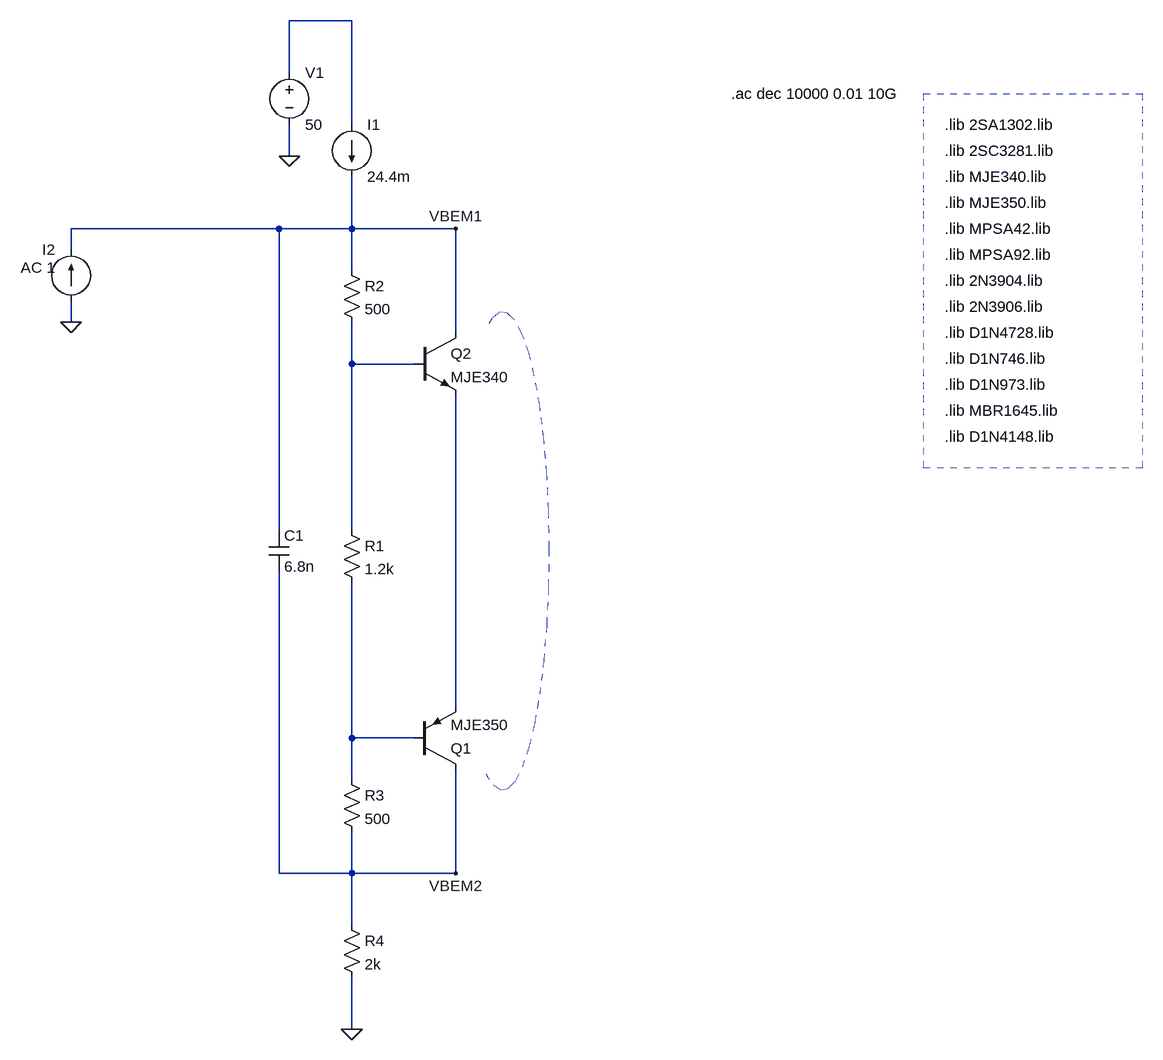
[diagram p0: schematic vbe_mult.asc]
vbe_mult.asc, the LTspice schematic file:
Version 4
SHEET 1 1316 964
WIRE 96 -608 0 -608
WIRE 0 -528 0 -608
WIRE 96 -448 96 -608
WIRE 0 -400 0 -448
WIRE -16 -288 -336 -288
WIRE 96 -288 96 -368
WIRE 96 -288 -16 -288
WIRE 256 -288 96 -288
WIRE -336 -256 -336 -288
WIRE 96 -224 96 -288
WIRE -336 -144 -336 -176
WIRE 256 -128 256 -288
WIRE 96 -80 96 -144
WIRE 192 -80 96 -80
WIRE -16 176 -16 -288
WIRE 96 176 96 -80
WIRE 256 448 256 -32
WIRE 96 496 96 256
WIRE 192 496 96 496
WIRE 96 560 96 496
WIRE -16 704 -16 240
WIRE 96 704 96 640
WIRE 96 704 -16 704
WIRE 256 704 256 544
WIRE 256 704 96 704
WIRE 96 784 96 704
WIRE 96 944 96 864
FLAG 256 -288 VBEM1
FLAG 256 704 VBEM2
FLAG 0 -400 0
FLAG 96 944 0
FLAG -336 -144 0
DATAFLAG 400 208 "V(vbem1)-V(vbem2)"
DATAFLAG 416 704 ""
DATAFLAG 400 -288 ""
DATAFLAG 256 -224 ""
DATAFLAG 256 656 ""
SYMBOL pnp 192 544 M180
SYMATTR InstName Q1
SYMATTR Value MJE350
SYMBOL npn 192 -128 R0
SYMATTR InstName Q2
SYMATTR Value MJE340
SYMBOL res 80 160 R0
SYMATTR InstName R1
SYMATTR Value 1.2k
SYMBOL res 80 -240 R0
SYMATTR InstName R2
SYMATTR Value 500
SYMBOL res 80 544 R0
SYMATTR InstName R3
SYMATTR Value 500
SYMBOL current 96 -448 R0
SYMATTR InstName I1
SYMATTR Value 24.4m
SYMBOL voltage 0 -544 R0
SYMATTR InstName V1
SYMATTR Value 50
SYMBOL res 80 768 R0
SYMATTR InstName R4
SYMATTR Value 2k
SYMBOL current -336 -176 R180
WINDOW 0 24 80 Left 2
WINDOW 3 24 0 Left 2
WINDOW 123 24 52 Left 2
WINDOW 39 0 0 Left 0
SYMATTR InstName I2
SYMATTR Value ""
SYMATTR Value2 AC 1
SYMBOL cap -32 176 R0
SYMATTR InstName C1
SYMATTR Value 6.8n
TEXT 680 -496 Left 2 !.ac dec 10000 0.01 10G
TEXT 1008 -448 Left 2 !.lib 2SA1302.lib
TEXT 1008 -408 Left 2 !.lib 2SC3281.lib
TEXT 1008 -128 Left 2 !.lib D1N4728.lib
TEXT 1008 -8 Left 2 !.lib MBR1645.lib
TEXT 1008 -368 Left 2 !.lib MJE340.lib
TEXT 1008 -328 Left 2 !.lib MJE350.lib
TEXT 1008 32 Left 2 !.lib D1N4148.lib
TEXT 1008 -288 Left 2 !.lib MPSA42.lib
TEXT 1008 -248 Left 2 !.lib MPSA92.lib
TEXT 1008 -88 Left 2 !.lib D1N746.lib
TEXT 1008 -48 Left 2 !.lib D1N973.lib
TEXT 1008 -208 Left 2 !.lib 2N3904.lib
TEXT 1008 -168 Left 2 !.lib 2N3906.lib
RECTANGLE Normal 1312 80 976 -496 2
ARC Normal 256 -160 400 576 301 565 299 -155 2

The netlist it stands for:
* vbe_mult.asc
Q1 VBEM2 N004 N003 0 MJE350
Q2 VBEM1 N002 N003 0 MJE340
R1 N002 N004 1.2k
R2 VBEM1 N002 500
R3 N004 VBEM2 500
I1 N001 VBEM1 24.4m
V1 N001 0 50
R4 VBEM2 0 2k
I2 0 VBEM1 AC 1
C1 VBEM1 VBEM2 6.8n
.model NPN NPN
.model PNP PNP
.lib standard.bjt
.ac dec 10000 0.01 10G
.lib 2SA1302.lib
.lib 2SC3281.lib
.lib D1N4728.lib
.lib MBR1645.lib
.lib MJE340.lib
.lib MJE350.lib
.lib D1N4148.lib
.lib MPSA42.lib
.lib MPSA92.lib
.lib D1N746.lib
.lib D1N973.lib
.lib 2N3904.lib
.lib 2N3906.lib
.backanno
.end